# Altium schematic sheet daisy_chain_connectors.SchDoc
size A3; DocumentNumber: 15; SheetNumber: 15; SheetTotal: 19; SheetDescription: Daisy Chain Connectors
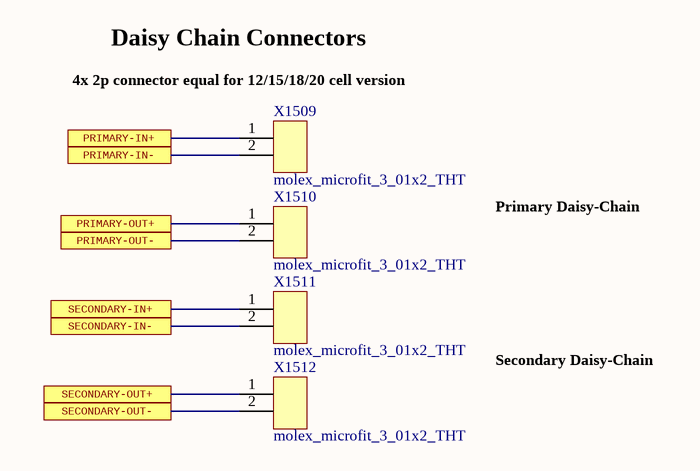
[diagram p0: daisy_chain_connectors.SchDoc]

## Parts
X1509  molex_microfit_3_01x2_THT  [MOLEX_MICROFIT_01x2_THT]
X1510  molex_microfit_3_01x2_THT  [MOLEX_MICROFIT_01x2_THT]
X1511  molex_microfit_3_01x2_THT  [MOLEX_MICROFIT_01x2_THT]
X1512  molex_microfit_3_01x2_THT  [MOLEX_MICROFIT_01x2_THT]

## Ports
PRIMARY-IN+, PRIMARY-IN-, PRIMARY-OUT+, PRIMARY-OUT-, SECONDARY-IN+, SECONDARY-IN-, SECONDARY-OUT+, SECONDARY-OUT-

## Nets
PRIMARY-IN+: X1509.1 ; port PRIMARY-IN+
PRIMARY-IN-: X1509.2 ; port PRIMARY-IN-
PRIMARY-OUT+: X1510.1 ; port PRIMARY-OUT+
PRIMARY-OUT-: X1510.2 ; port PRIMARY-OUT-
SECONDARY-IN+: X1511.1 ; port SECONDARY-IN+
SECONDARY-IN-: X1511.2 ; port SECONDARY-IN-
SECONDARY-OUT+: X1512.1 ; port SECONDARY-OUT+
SECONDARY-OUT-: X1512.2 ; port SECONDARY-OUT-

## Notes on the sheet
- Daisy Chain Connectors
- (near X1509) 4x 2p connector equal for 12/15/18/20 cell version
- Primary Daisy-Chain
- Secondary Daisy-Chain
- Fraunhofer IISB
- Schottkystr. 10
- developed by:
- 91058 Erlangen
- Germany
- Author
- Project
- License
- Description
- File
- Version
- Release Date
- Sheet
- www.foxbms.org
- www.iisb.fraunhofer.de
- foxBMS Team
- /

## Library data of the parts
X1509-X1512 = molex_microfit_3_01x2_THT: Micro-Fit 3.0 Right Angle Header, 3.00mm Pitch, Dual Row, 2 Circuits, with Snap-in Plastic Peg PCB Lock, Tin, Glow Wire Capable, Black, 43045-0200; Manufacturer: Molex; Circuits: 2; Rated Voltage: 600V; Rated Current: 8.5A; Automotive Qualified: False; Part Number: molex_microfit_3_01x2_THT; Part Name: MicroFit; Operating Temperature: -40°C - +105°C; Supplier 1: Farnell; Supplier Part Number 1: 1012251